# Altium schematic sheet l1.SchDoc: Oncilla L1 (hip) magnetic encoder
size A4; Author: Rico Möckel; Organization: BioRob / EPFL; DocumentNumber: 1; Revision: 2; SheetNumber: 1; SheetTotal: 1
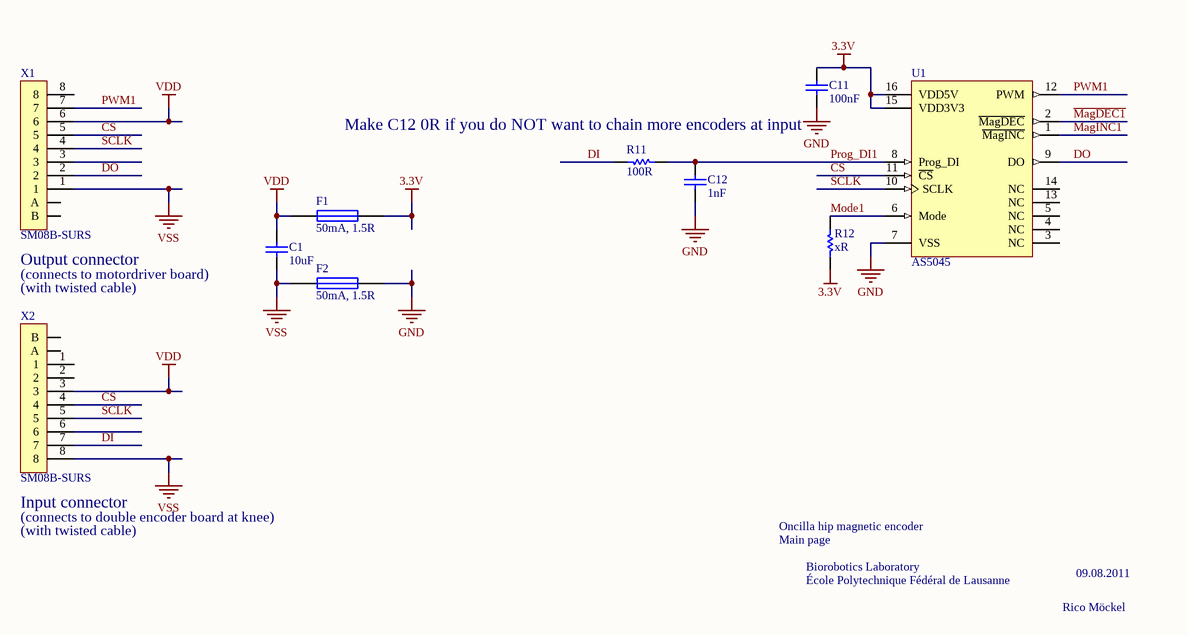
[diagram p0: l1.SchDoc]

## Parts
C1  10uF  [CAPC1608L]
C11  100nF  [CAPC1608L]
C12  1nF  [CAPC1608L]
F1  50mA, 1.5R  [RESC1608L]
F2  50mA, 1.5R  [RESC1608L]
R11  100R  [RESC1608L]
R12  xR  [RESC1608L]
U1  AS5045  [SSOP16]
X1  SM08B-SURS  [SM08B-SURS]
X2  SM08B-SURS  [SM08B-SURS]

## Nets
3.3V: C11.1 F1.2 R12.1 U1.15(VDD3V3) U1.16(VDD5V)
GND: C11.2 C12.2 F2.2 U1.7(VSS)
VDD: C1.2 F1.1 X1.6 X2.3
VSS: C1.1 F2.1 X1.1 X2.8
~{CS}: U1.11(~{CS}) X1.5 X2.4
DI: R11.1 X2.7
DO: U1.9(DO) X1.2
~{MagDEC1}: U1.2(~{MagDEC})
~{MagINC1}: U1.1(~{MagINC})
Mode1: R12.2 U1.6(Mode)
Prog_DI1: C12.1 R11.2 U1.8(Prog_DI)
PWM1: U1.12(PWM) X1.7
SCLK: U1.10(SCLK) X1.4 X2.5

Not connected (* = marked no-connect by the designer): U1 3(NC) 4(NC) 5(NC) 13(NC) 14(NC); X1 3 8 A B; X2 1 2 6 A B

## Notes on the sheet
- Make C12 0R if you do NOT want to chain more encoders at input
- (near X1) Output connector
- (connects to motordriver board)
- (with twisted cable)
- (near X2) Input connector
- (near X2) (connects to double encoder board at knee)
- Oncilla hip magnetic encoder
- Main page
- École Polytechnique Fédéral de Lausanne
- Biorobotics Laboratory
- 09.08.2011
- Rico Möckel
- Title
- Size:
- Date:
- A4
- Number:
- Time:
- Revision:
- Sheet
- of
- File:

## Library data of the parts
C1 C11 C12 = Cap: Capacitor; Published: 8-Jun-2000; LatestRevisionDate: 17-Jul-2002; LatestRevisionNote: Re-released for DXP Platform.; PackageReference: 0603; Publisher: Altium Limited
F1 F2 = Fuse 1: Ferrit Bead; Published: 8-Jun-2000; LatestRevisionDate: 17-Jul-2002; LatestRevisionNote: Re-released for DXP Platform.; PackageReference: PIN-W2/E2.8; Publisher: Altium Limited
R11 R12 = Res1: Resistor; Published: 8-Jun-2000; LatestRevisionDate: 17-Jul-2002; LatestRevisionNote: Re-released for DXP Platform.; PackageReference: AXIAL-0.3; Publisher: Altium Limited
U1 = AS5045: 12 Bit Programmable Magnetic Rotary Encoder
X1 X2 = SM08B-SURS: wire-to-board connector